# EAGLE design moodbeam_v5 (EAGLE 7.2.0)
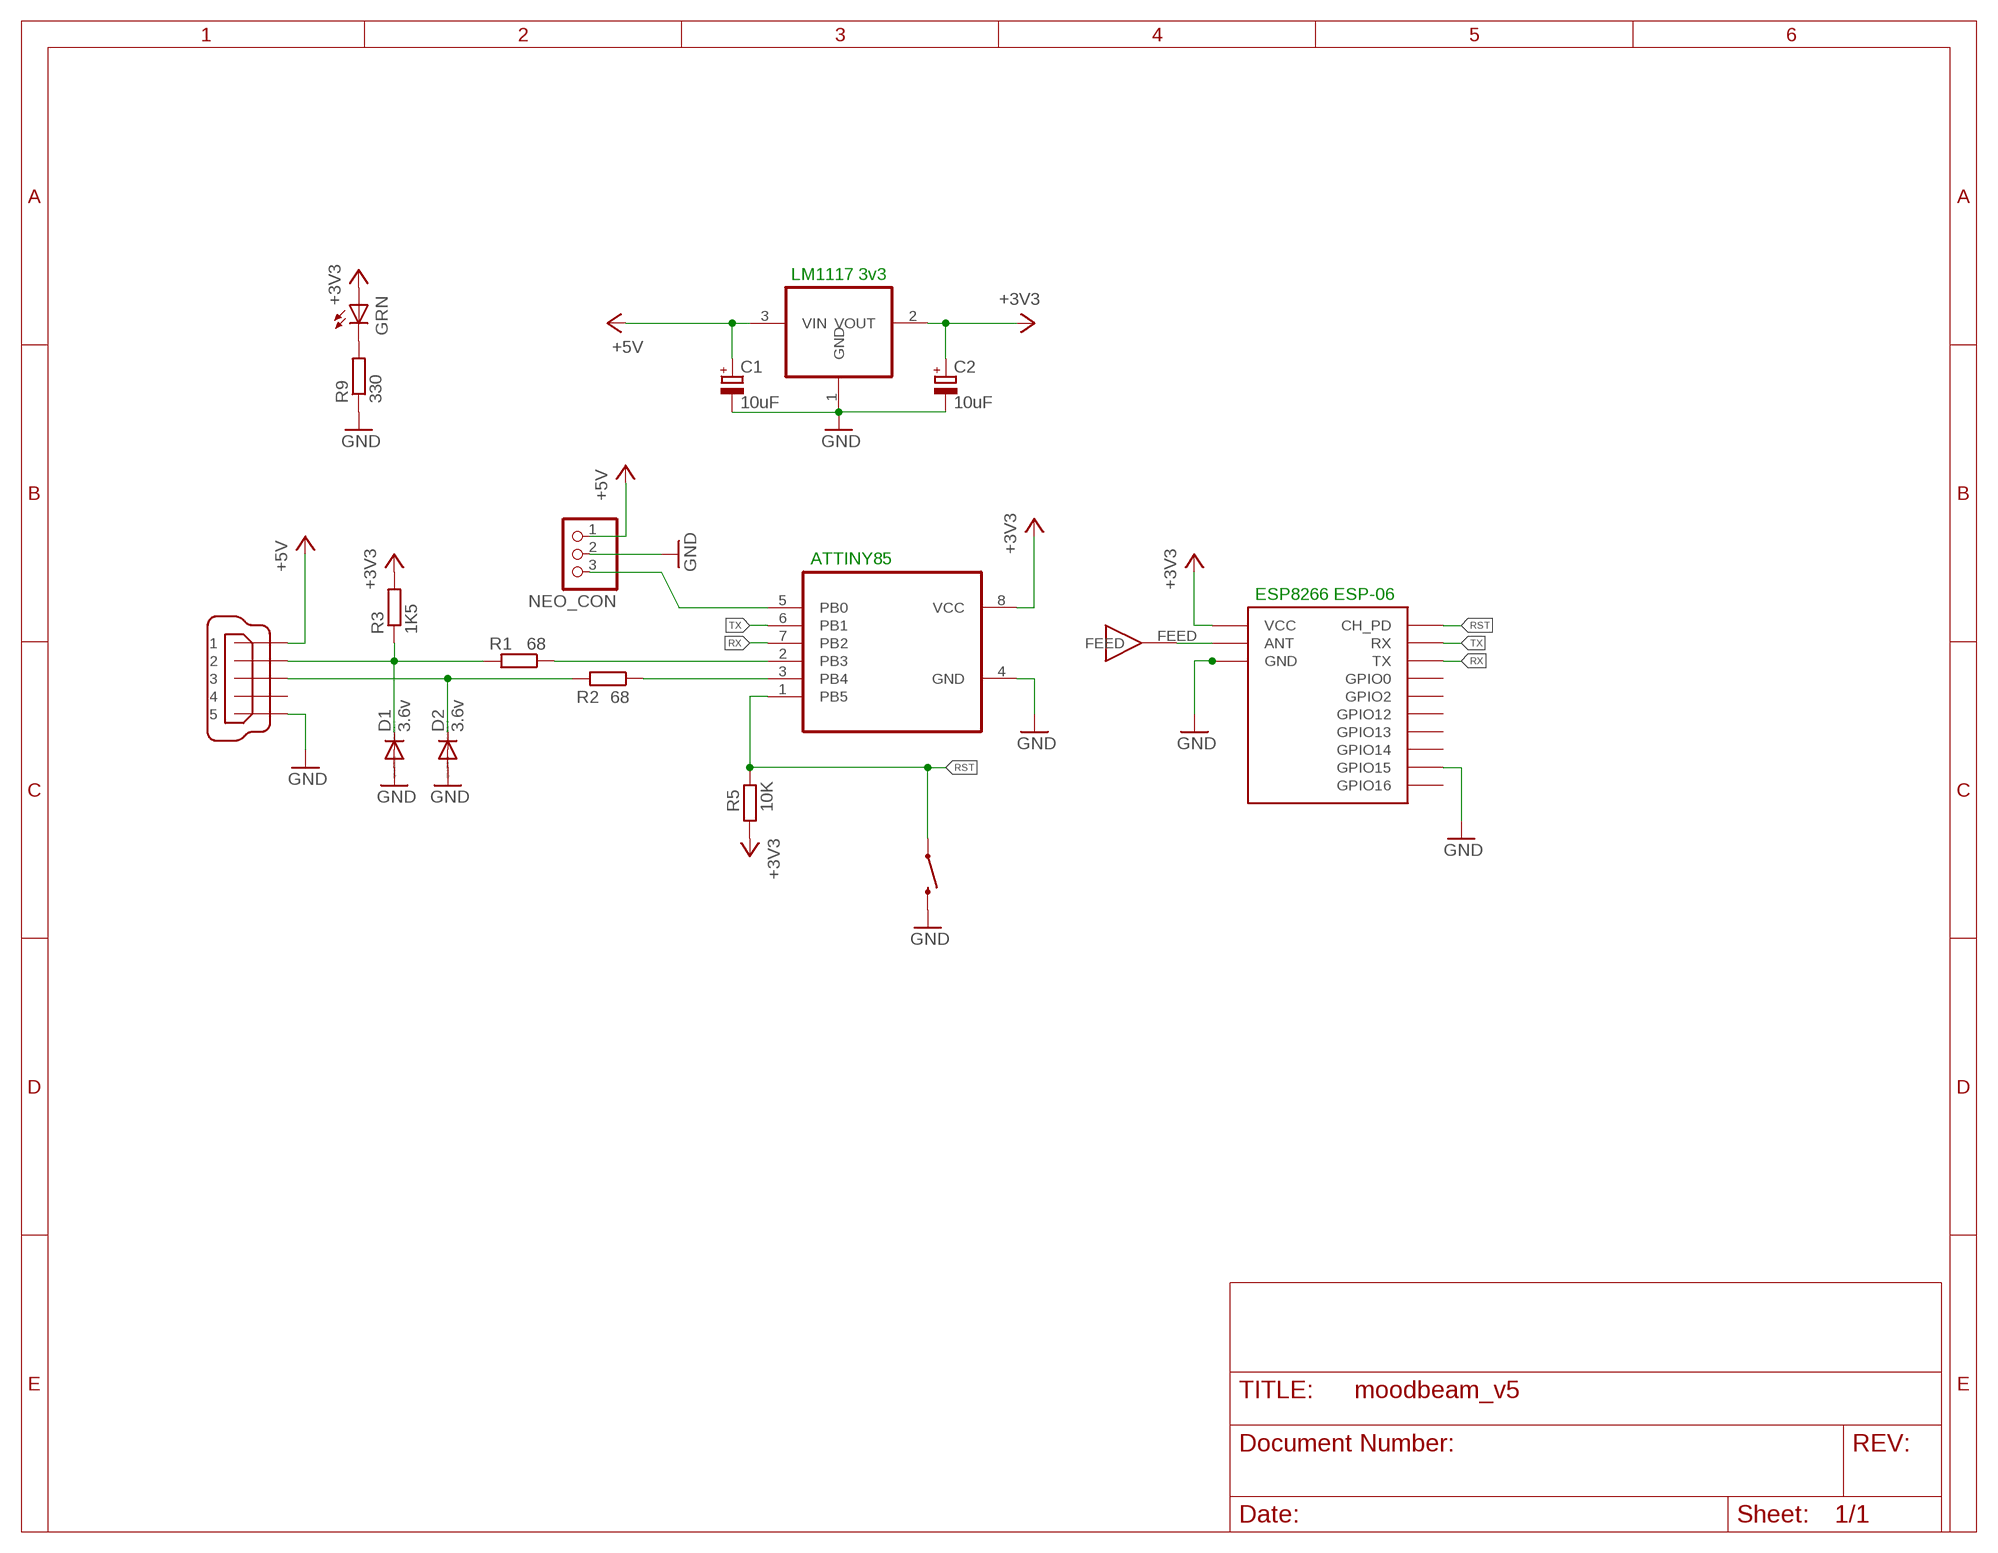
[diagram p0: schematic, sheet 1]

## Parts
C1  10uF  CPOL-EUR/2012-12R  [R/2012-12R]
C2  10uF  CPOL-EUR/2012-12R  [R/2012-12R]
D1  3.6v  DIODE-DO-214AC  [DO-214AC]
D2  3.6v  DIODE-DO-214AC  [DO-214AC]
IC1  REG1117  [SOT223]
JP1  NEO_CON  PINHD-1X3  [1X03]
LED1  GRN  LEDCHIP-LED0805  [CHIP-LED0805]
R1  68  R-EU_R0805  [R0805]
R2  68  R-EU_R0805  [R0805]
R3  1K5  R-EU_R0805  [R0805]
R5  10K  R-EU_R0805  [R0805]
R9  330  R-EU_R0805  [R0805]
S1  SWITCH-MOMENTARY-2SMD-1101NE  [TACTILE-SWITCH-1101NE]
U1  ATTINY85-20SU  [SOIC127P798X216-8N]
U$1  ESP06  [ESP06]
U$2  ANT  [ANTENNA-CERAMIC]
X1  MINI-USB-32005-201  [32005-201]

## Nets
+3V3: C2.+ IC1.2(VOUT) LED1.A R3.2 R5.1 U1.8(VCC) U$1.VCC
+5V: C1.+ IC1.3(VIN) JP1.1 X1.1
GND: C1.- C2.- D1.A D2.A IC1.1(GND) JP1.2 R9.1 S1.2 U1.4(GND) U$1.GND U$1.GND1(GND2) U$1.GND2(GND3) U$1.GND3(GND4) U$1.GND4(GND5) U$1.GND5(GND6) U$1.GND6(GND7) U$1.GND7(GND8) U$1.GPIO15 X1.5
N$1: D1.C R1.2 R3.1 X1.2
N$2: R1.1 U1.2(PB3)
N$3: D2.C R2.2 X1.3
N$4: R2.1 U1.3(PB4)
N$5: U$1.ANT U$2.FEED
N$7: JP1.3 U1.5(PB0)
N$8: LED1.C R9.2
RST: R5.2 S1.1 U1.1(PB5) U$1.CH_PD
RX: U1.7(PB2) U$1.TX
TX: U1.6(PB1) U$1.RX
Unconnected: U$1.GPIO0 U$1.GPIO2 U$1.GPIO12 U$1.GPIO13 U$1.GPIO14 U$1.GPIO16 X1.4

## Notes on the sheet
- LM1117 3v3
- ATTINY85
- ESP8266 ESP-06

## Library data of the parts
C1 C2 = rcl:CPOL-EU: POLARIZED CAPACITOR, European symbol
D1 D2 = diode:DIODE-: DIODE
IC1 = burr-brown:REG1117: 800mA and 1A Low Dropout (LDO) Positive Regulator 1.8V, 2.5V, 2.85V, 3.3V, 5V, and Adj; MPN: LM1117 3v3; OC_FARNELL: 1097566; OC_NEWARK: 14P6981
JP1 = pinhead:PINHD-1X3: PIN HEADER
LED1 = led:LED: LED OSRAM: - CHIPLED LG R971, LG N971, LY N971, LG Q971, LY Q971, LO R971, LY R971 LH N974, LH R974 LS Q976, LO Q976, LY Q976 LO Q996 - Hyper CHIPLED LW Q18S LB Q993, LB Q99A, LB R99A - SideLED LS A670, LO A670, LY A670, LG A670, LP A670 LB A673, LV A673, LT A673, LW A673 LH A674 LY A675 LS A676, LA A676, LO A676, LY A676, LW A676 LS A679, LY A679, LG A679 - Hyper Micro SIDELED® LS Y876, LA Y876, LO Y876, LY Y876 LT Y87S - SmartLED LW L88C, LW L88S LB L89C, LB L89S, LG L890 LS L89K, LO L89K, LY L89K LS L896, LA L896, LO L896, LY L896 - TOPLED LS T670, LO T670, LY T670, LG T670, LP T670 LSG T670, LSP T670, LSY T670, LOP T670, LYG T670 LG T671, LOG T671, LSG T671 LB T673, LV T673, LT T673, LW T673 LH T674 LS T676, LA T676, LO T676, LY T676, LB T676, LH T676, LSB T676, LW T676 LB T67C, LV T67C, LT T67C, LS T67K, LO T67K, LY T67K, LW E67C LS E67B, LA E67B, LO E67B, LY E67B, LB E67C, LV E67C, LT E67C LW T67C LS T679, LY T679, LG T679 LS T770, LO T770, LY T770, LG T770, LP T770 LB T773, LV T773, LT T773, LW T773 LH T774 LS E675, LA E675, LY E675, LS T675 LS T776, LA T776, LO T776, LY T776, LB T776 LHGB T686 LT T68C, LB T68C - Hyper Mini TOPLED® LB M676 - Mini TOPLED Santana® LG M470 LS M47K, LO M47K, LY M47K Source: http://www.osram.convergy.de LUXEON: - LUMILED® LXK2-PW12-R00, LXK2-PW12-S00, LXK2-PW14-U00, LXK2-PW14-V00 LXK2-PM12-R00, LXK2-PM12-S00, LXK2-PM14-U00 LXK2-PE12-Q00, LXK2-PE12-R00, LXK2-PE12-S00, LXK2-PE14-T00, LXK2-PE14-U00 LXK2-PB12-K00, LXK2-PB12-L00, LXK2-PB12-M00, LXK2-PB14-N00, LXK2-PB14-P00, LXK2-PB14-Q00 LXK2-PR12-L00, LXK2-PR12-M00, LXK2-PR14-Q00, LXK2-PR14-R00 LXK2-PD12-Q00, LXK2-PD12-R00, LXK2-PD12-S00 LXK2-PH12-R00, LXK2-PH12-S00 LXK2-PL12-P00, LXK2-PL12-Q00, LXK2-PL12-R00 Source: www.luxeon.com KINGBRIGHT: KA-3528ASYC Source: www.kingbright.com
R1-R3 R5 R9 = resistor:R-EU_: RESISTOR, European symbol
S1 = SparkFun-Electromechanical:SWITCH-MOMENTARY-2: Various NO switches- pushbuttons, reed, etc; PROD_ID: SWCH-00815
U1 = attiny85:ATTINY85-20SU: 8-bit Microcontroller with In-System Programmable Flash; MPN: ATTINY85-20SU; OC_FARNELL: 1455164; OC_NEWARK: 58M3797; PACKAGE: SOIC-8; SUPPLIER: Atmel
U$1 = esp8266modules:ESP06: ESP8266 Wifi module 06
U$2 = rainsun-ant:ANT
X1 = con-cypressindustries:MINI-USB-: MINI USB-B Conector Source: www.cypressindustries.com; OC_FARNELL: unknown; OC_NEWARK: unknown

## Board
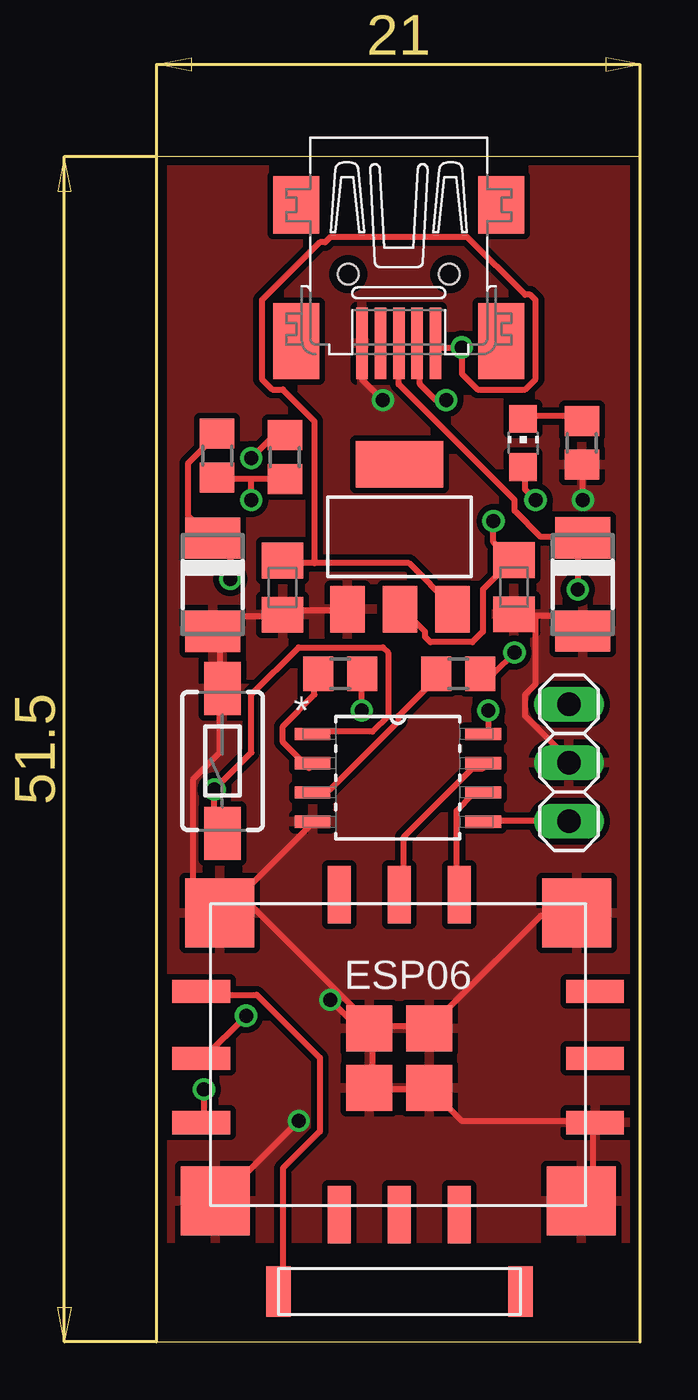
[diagram p1: board, top side]
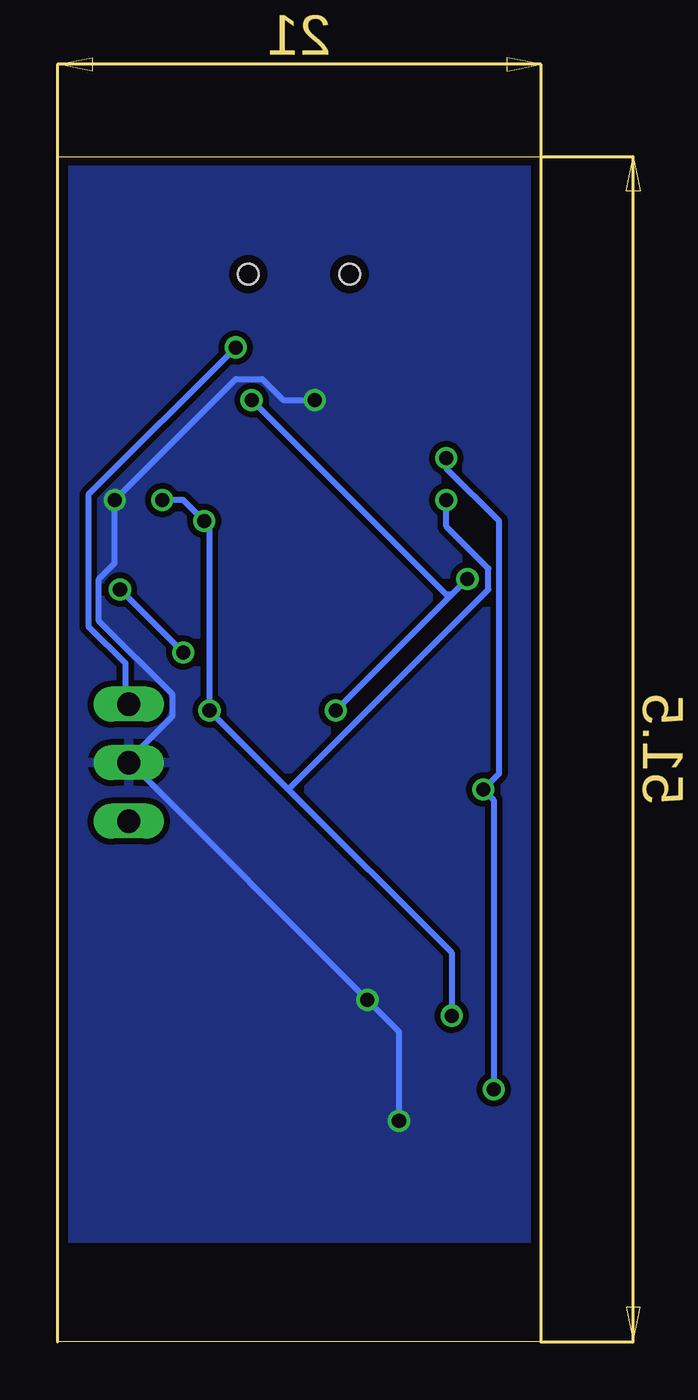
[diagram p2: board, bottom side, seen from below]

Size 21 x 51.5 mm. Coordinates in mm from the lower left corner, seen from the top.
Outline: 0,0 21,0 21,51.5 0,51.5 0,0
Copper layers (1*16): Top 0.0356mm / dielectric 1.5011mm / Bottom 0.0356mm
Design rules "LaenPCBOrder": minimum track width 6mil, minimum drill 13mil, track to track 6mil, track to pad 6mil, pad to pad 6mil, via to via 6mil, smd to smd 6mil, copper to edge 15mil, drill to drill 6mil, minimum pad ring 7mil, minimum via ring 7mil, stop-mask expansion 3mil, vias tented up to drill 0mil, thermal gap 10mil

### Footprints (pad centres in the part's own frame; a part is rotated, then mirrored left to right if it is on the bottom)
R/2012-12R = smd 1.55 x 1.8: + 1.175,0; - -1.175,0
DO-214AC = smd 1.8 x 2.4: A 2.025,0; C -2.025,0
SOT223 = smd 1.499 x 2.007: 1 -2.261,-3.15; 2 0.025,-3.15; 3 2.311,-3.15 | smd 3.81 x 2.007: 4 0,3.15
1X03 = drill 1.016 long: 1 -2.54,0; 2 0,0; 3 2.54,0
CHIP-LED0805 = smd 1.2 x 1.2: A 0,-1.05; C 0,1.05
R0805 = smd 1.3 x 1.5: 1 -0.95,0; 2 0.95,0
TACTILE-SWITCH-1101NE = smd 2.3 x 1.6: 1 -3.15,0; 2 3.15,0
SOIC127P798X216-8N = smd 1.549 x 0.533: 1 -3.708,1.905; 2 -3.708,0.635; 3 -3.708,-0.635; 4 -3.708,-1.905; 5 3.708,-1.905; 6 3.708,-0.635; 7 3.708,0.635; 8 3.708,1.905
ESP06 = smd 2.5 x 1: ANT -8.4,3.3; CH_PD -8.4,-2.4; GPIO0 8.7,3.3; GPIO2 8.7,0.4; GPIO15 8.7,-2.4; VCC -8.4,0.4 | smd 3 x 3: GND -7.6,6.7; GND1 -7.8,-5.8; GND2 8.1,-5.8; GND3 7.9,6.7 | smd 2 x 2: GND4 -1.1,1.7; GND5 1.5,1.7; GND6 1.5,-0.9; GND7 -1.1,-0.9 | smd 1 x 2.5: GPIO12 0.2,-6.4; GPIO13 2.8,-6.4; GPIO14 -2.4,-6.4; GPIO16 -2.4,7.5; RX 2.8,7.5; TX 0.2,7.5
ANTENNA-CERAMIC = smd 1.067 x 2.184: FEED 5.5,0; NC -5,0
32005-201 = smd 3.1 x 0.5: 1 3,1.6; 2 3,0.8; 3 3,0; 4 3,-0.8; 5 3,-1.6 | smd 2.5 x 2: M1 -3,-4.45; M2 -3,4.45 | smd 3.3 x 2: M3 2.9,4.45; M4 2.9,-4.45 | hole 0.9: 0,2.2; 0,-2.2

### Placement (x,y rotation side)
C1  5.47,32.77 90 top
C2  15.52,32.79 90 top
D1  2.44,32.9 270 top
D2  18.51,32.91 270 top
IC1  10.55,34.98 0 top
JP1  17.91,25.17 270 top
LED1  15.92,39.06 0 top
R1  7.98,29.03 0 top
R2  13.1,29.03 0 top
R3  2.63,38.51 270 top
R5  5.57,38.44 90 top
R9  18.47,39.06 90 top
S1  2.86,25.24 90 top
U1  10.48,24.51 0 top
U$1  10.34,11.93 0 top
U$2  10.8,2.19 180 top
X1  10.52,46.39 270 top

### Tracks (layer width: path | path; a pad name or v marks a point on that pad's centre or on a via)
+3V3  (via drill 0.61)
  Top 0.254: 4.12,37.49 5.49,37.49 R5.1 | 4.12,37.49 2.74,37.49 R3.2 | v16.46,36.58 16,37.03 16,37.95 LED1.A | v14.63,35.66 14.63,34.75 15.32,34.06 C2.+ 15.32,33.83 14.17,32.69 14.17,30.86 13.72,30.4 11.89,30.4 11.66,30.63 11.66,30.86 10.74,31.77 IC1.2 | v14.4,27.43 14.4,26.52 U1.8 | v3.89,14.17 2.06,12.34 U$1.VCC | v4.12,36.58 4.12,37.49
  Bottom 0.254: v16.46,36.58 15.54,36.58 v14.63,35.66 14.4,35.43 v14.4,27.43 10.97,24 | v3.89,14.17 3.89,16.92 10.97,24 | v4.12,36.58 4.12,35.43 2.29,33.6 2.29,32.69 10.97,24
+5V  (via drill 0.61)
  Top 0.254: 6.86,33.83 10.97,33.83 12.8,32 IC1.3 | 6.86,33.83 5.49,33.83 C1.+ | X1.1 12.34,43.2 v13.26,43.2 13.26,42.06 13.95,41.38 16,41.38 16.46,41.83 16.46,45.26 16.23,45.49 16,45.49 13.49,48.01 7.54,48.01 7.32,47.78 7.09,47.78 4.57,45.26 4.57,41.83 5.03,41.38 5.49,41.38 6.86,40.01 6.86,33.83
  Bottom 0.254: v13.26,43.2 19.66,36.8 19.66,31.09 18.06,29.49 18.06,27.89 JP1.1
GND  (via drill 0.61)
  Top 0.254: IC1.1 8.23,31.77 5.49,31.77 C1.- 5.26,31.55 2.97,31.55 2.52,31.09 D1.A 2.52,30.86 2.74,30.63 2.74,28.57 S1.2 2.74,28.35 2.74,25.6 1.6,24.46 1.6,19.66 2.52,18.75 U$1.GND | 3.66,19.43 2.74,18.52 U$1.GND | 3.66,19.43 6.63,22.4 U1.4 | U$1.GND2 18.52,6.17 18.97,6.63 18.97,9.37 U$1.GPIO15 18.97,9.6 13.26,9.6 11.89,10.97 U$1.GND6 11.66,10.97 9.37,10.97 U$1.GND7 9.37,11.2 9.37,13.49 U$1.GND4 | 9.37,13.72 11.66,13.72 U$1.GND5 11.89,13.72 16.69,18.52 18.06,18.52 U$1.GND3 | 9.37,13.72 3.66,19.43 | 3.66,19.43 U$1.GND | 9.37,13.72 U$1.GND4 | 16.46,31.55 17.83,31.55 18.29,31.09 D2.A | 16.46,31.55 15.54,31.55 C2.- | v18.52,36.58 18.52,37.95 | v6.17,9.6 2.74,6.17 U$1.GND1 | v9.83,40.92 8.91,41.83 8.91,43.2 X1.5 | 16.46,31.55 16.46,28.57 16,28.12 16,27.2 17.83,25.38 JP1.2 | v7.54,14.86 8.69,13.72 9.14,13.72 U$1.GND4
  Bottom 0.254: v6.17,9.6 6.17,13.49 v7.54,14.86 17.83,25.15 JP1.2 17.83,25.38 16,27.2 16,28.12 19.2,31.32 19.2,33.15 18.52,33.83 v18.52,36.58 13.26,41.83 12.12,41.83 11.2,40.92 v9.83,40.92
  pour Bottom (isolate 0.254): 0,51.5 21,51.5 21,4.5 0,4.5
  pour Top (isolate 0.254): 0,51.5 21,51.5 21,4.5 0,4.5
N$1  (via drill 0.61)
  Top 0.254: v8.91,27.43 8.91,28.8 R1.2 | v3.2,33.15 3.2,34.06 2.52,34.75 D1.C 2.29,34.98 1.37,35.89 1.37,38.18 2.52,39.32 R3.1 | v12.57,40.92 12.12,40.92 11.43,41.6 11.43,43.2 X1.2
  Bottom 0.254: v3.2,33.15 3.89,32.46 | 3.89,32.46 v8.91,27.43 | v12.57,40.92 4.12,32.46 3.89,32.46
N$2
  Top 0.254: R1.1 6.86,28.8 6.86,28.12 5.49,26.75 5.49,26.06 6.63,24.92 U1.2
N$3  (via drill 0.61)
  Top 0.254: v15.54,29.95 14.63,29.03 14.17,29.03 R2.2 | v18.29,32.69 18.29,34.75 D2.C 18.29,34.98 16.69,34.98 15.54,36.12 15.54,36.58 10.52,41.6 10.52,43.2 X1.3
  Bottom 0.254: v18.29,32.69 v15.54,29.95
N$4
  Top 0.254: R2.1 12.12,28.8 10.52,27.2 10.52,26.98 7.54,24 6.86,24 U1.3
N$5
  Top 0.254: U$2.FEED 5.49,2.29 5.49,7.54 7.09,9.14 7.09,12.34 4.34,15.09 2.06,15.09 U$1.ANT
N$7
  Top 0.254: U1.5 14.4,22.63 17.83,22.63 JP1.3
N$8
  Top 0.254: LED1.C 16,40.23 18.29,40.23 R9.2
RST  (via drill 0.61)
  Top 0.254: v4.12,38.41 5.03,39.32 5.49,39.32 R5.2 | S1.1 2.74,22.17 2.52,22.4 v2.52,24 4.12,25.6 4.12,28.12 6.17,30.18 9.83,30.18 10.06,29.95 10.06,27.2 9.37,26.52 6.86,26.52 U1.1 | v2.06,10.97 2.06,9.6 U$1.CH_PD
  Bottom 0.254: v4.12,38.41 4.12,37.95 1.83,35.66 1.83,24.69 v2.52,24 2.06,23.55 v2.06,10.97
RX
  Top 0.254: U1.7 14.17,24.92 13.72,24.92 10.74,21.95 10.74,19.43 U$1.TX
TX
  Top 0.254: U1.6 14.17,23.77 13.72,23.77 13.03,23.09 13.03,19.43 U$1.RX